# Altium schematic sheet main.SchDoc
size A4; Organization: Altium Limited; Address1: 3 Minna Close; Address2: Belrose; Address3: NSW 2085; Address4: Australia
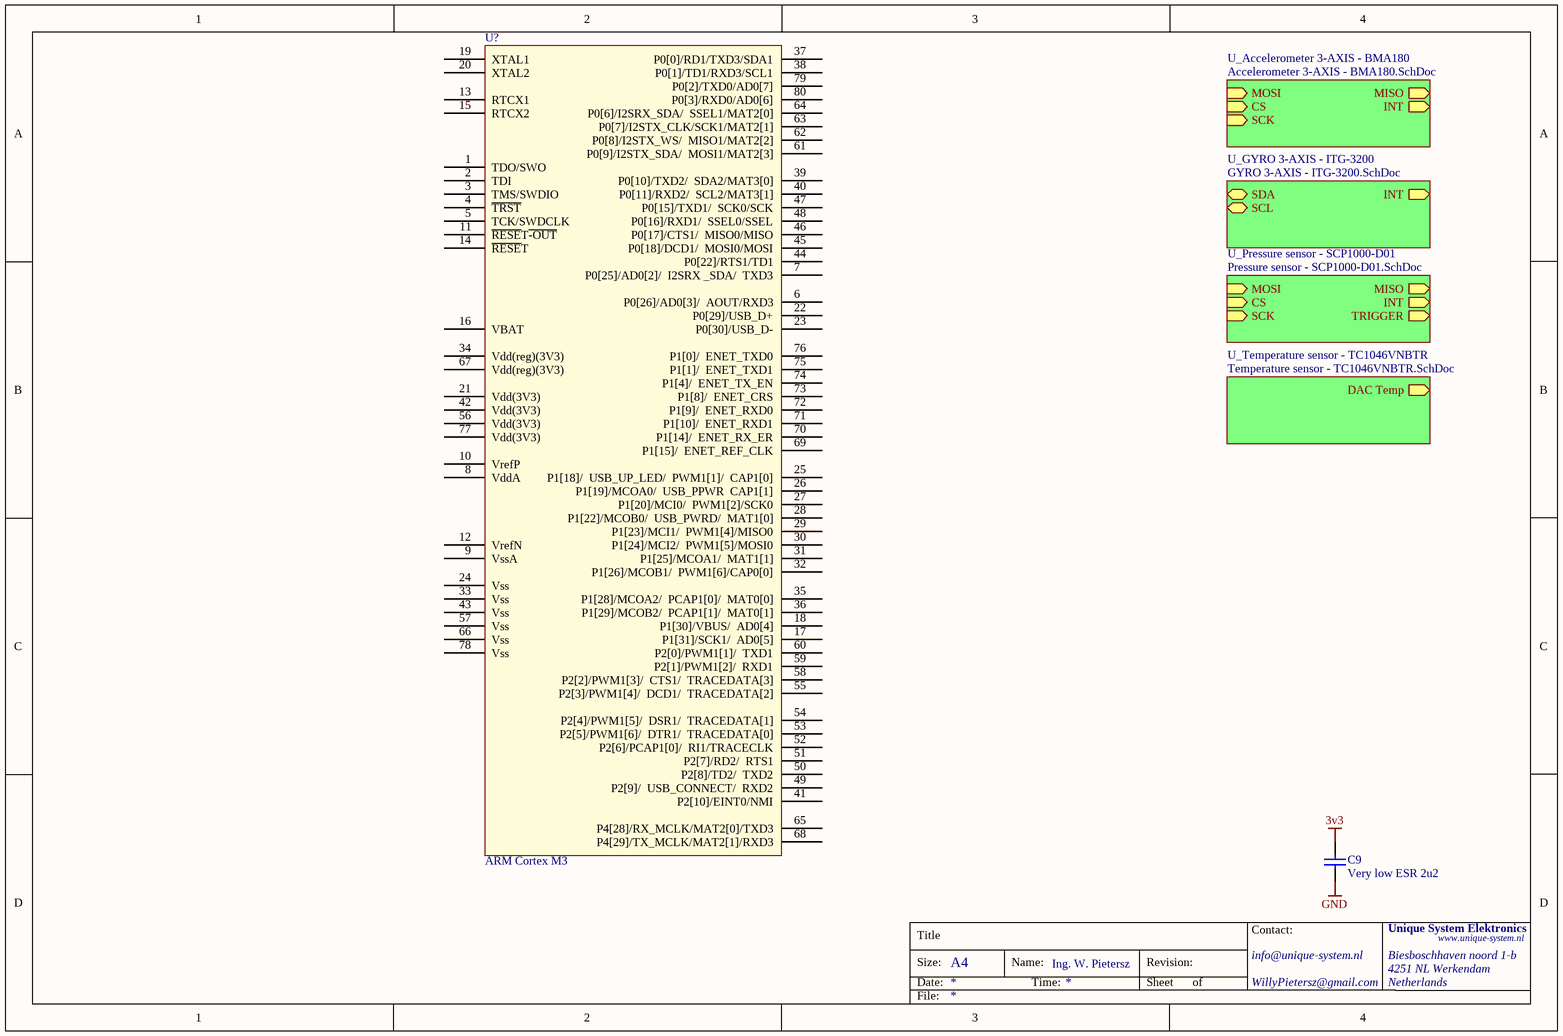
[diagram p0: main.SchDoc]

## Parts
C9  Very low ESR 2u2  [C1210]
U?  ARM Cortex M3  [LQFP80]

## Sub-sheets
U_Accelerometer 3-AXIS - BMA180 = Accelerometer 3-AXIS - BMA180.SchDoc: MOSI (in), MISO (out), CS (in), SCK (in), INT (out)
U_GYRO 3-AXIS - ITG-3200 = GYRO 3-AXIS - ITG-3200.SchDoc: SDA (bidir), SCL (bidir), INT (out)
U_Pressure sensor - SCP1000-D01 = Pressure sensor - SCP1000-D01.SchDoc: MOSI (in), MISO (out), CS (in), SCK (in), INT (out), TRIGGER (out)
U_Temperature sensor - TC1046VNBTR = Temperature sensor - TC1046VNBTR.SchDoc: DAC Temp (out)

## Nets
3v3: C9.2
GND: C9.1

Not connected (* = marked no-connect by the designer): U? 1(TDO/SWO) 2(TDI) 3(TMS/SWDIO) 4(~{TRST}) 5(TCK/SWDCLK) 6(P0[26]/AD0[3]/__AOUT/RXD3) 7(P0[25]/AD0[2]/__I2SRX__SDA/__TXD3) 8(VddA) 9(VssA) 10(VrefP) 11(~{RESE}T~{-OUT}) 12(VrefN) 13(RTCX1) 14(~{RESE}T) 15(RTCX2) 16(VBAT) 17(P1[31]/SCK1/__AD0[5]) 18(P1[30]/VBUS/__AD0[4]) 19(XTAL1) 20(XTAL2) 21(Vdd(3V3)) 22(P0[29]/USB_D+) 23(P0[30]/USB_D-) 24(Vss) 25(P1[18]/__USB_UP_LED/__PWM1[1]/__CAP1[0]) 26(P1[19]/MCOA0/__USB_PPWR__CAP1[1]) 27(P1[20]/MCI0/__PWM1[2]/SCK0) 28(P1[22]/MCOB0/__USB_PWRD/__MAT1[0]) 29(P1[23]/MCI1/__PWM1[4]/MISO0) 30(P1[24]/MCI2/__PWM1[5]/MOSI0) 31(P1[25]/MCOA1/__MAT1[1]) 32(P1[26]/MCOB1/__PWM1[6]/CAP0[0]) 33(Vss) 34(Vdd(reg)(3V3)) 35(P1[28]/MCOA2/__PCAP1[0]/__MAT0[0]) 36(P1[29]/MCOB2/__PCAP1[1]/__MAT0[1]) 37(P0[0]/RD1/TXD3/SDA1) 38(P0[1]/TD1/RXD3/SCL1) 39(P0[10]/TXD2/__SDA2/MAT3[0]) 40(P0[11]/RXD2/__SCL2/MAT3[1]) 41(P2[10]/EINT0/NMI) 42(Vdd(3V3)) 43(Vss) 44(P0[22]/RTS1/TD1) 45(P0[18]/DCD1/__MOSI0/MOSI) 46(P0[17]/CTS1/__MISO0/MISO) 47(P0[15]/TXD1/__SCK0/SCK) 48(P0[16]/RXD1/__SSEL0/SSEL) 49(P2[9]/__USB_CONNECT/__RXD2) 50(P2[8]/TD2/__TXD2) 51(P2[7]/RD2/__RTS1) 52(P2[6]/PCAP1[0]/__RI1/TRACECLK) 53(P2[5]/PWM1[6]/__DTR1/__TRACEDATA[0]) 54(P2[4]/PWM1[5]/__DSR1/__TRACEDATA[1]) 55(P2[3]/PWM1[4]/__DCD1/__TRACEDATA[2]) 56(Vdd(3V3)) 57(Vss) 58(P2[2]/PWM1[3]/__CTS1/__TRACEDATA[3]) 59(P2[1]/PWM1[2]/__RXD1) 60(P2[0]/PWM1[1]/__TXD1) 61(P0[9]/I2STX_SDA/__MOSI1/MAT2[3]) 62(P0[8]/I2STX_WS/__MISO1/MAT2[2]) 63(P0[7]/I2STX_CLK/SCK1/MAT2[1]) 64(P0[6]/I2SRX_SDA/__SSEL1/MAT2[0]) 65(P4[28]/RX_MCLK/MAT2[0]/TXD3) 66(Vss) 67(Vdd(reg)(3V3)) 68(P4[29]/TX_MCLK/MAT2[1]/RXD3) 69(P1[15]/__ENET_REF_CLK) 70(P1[14]/__ENET_RX_ER) 71(P1[10]/__ENET_RXD1) 72(P1[9]/__ENET_RXD0) 73(P1[8]/__ENET_CRS) 74(P1[4]/__ENET_TX_EN) 75(P1[1]/__ENET_TXD1) 76(P1[0]/__ENET_TXD0) 77(Vdd(3V3)) 78(Vss) 79(P0[2]/TXD0/AD0[7]) 80(P0[3]/RXD0/AD0[6])

## Notes on the sheet
- Title
- Size:
- Date:
- A4
- Name:
- Time:
- Ing. W. Pietersz
- Revision:
- Sheet
- of
- WillyPietersz@gmail.com
- Contact:
- info@unique-system.nl
- Unique System Elektronics
- Biesboschhaven noord 1-b
- 4251 NL Werkendam
- Netherlands
- www.unique-system.nl
- File:

## Library data of the parts
C9 = 2.2uF-1210-X7R: Voltage: 50V; Type: X7R; Tolerance: 0.1; Part Number: 2.2uF-1210-X7R; Value: 2.2uF-1210-X7R; Package: 1210; Component Type: Low ESR; LatestRevision Date: 14-9-2010; Author: Willem Pietersz; Supplier 2: Farnell; Supplier Part Number 2: 1414066
U? = LPC175x: Part Number: LPC175x; Component Type: UC, ARM; Supplier 2: Farnell; Supplier Part Number 2: 1718541; ComponentLink1Description: Datasheet; ComponentLink1URL: http://www.nxp.com/acrobat/datasheets/LPC1758_56_54_52_51_2.pdf